# Altium schematic sheet MCU.SchDoc
size A
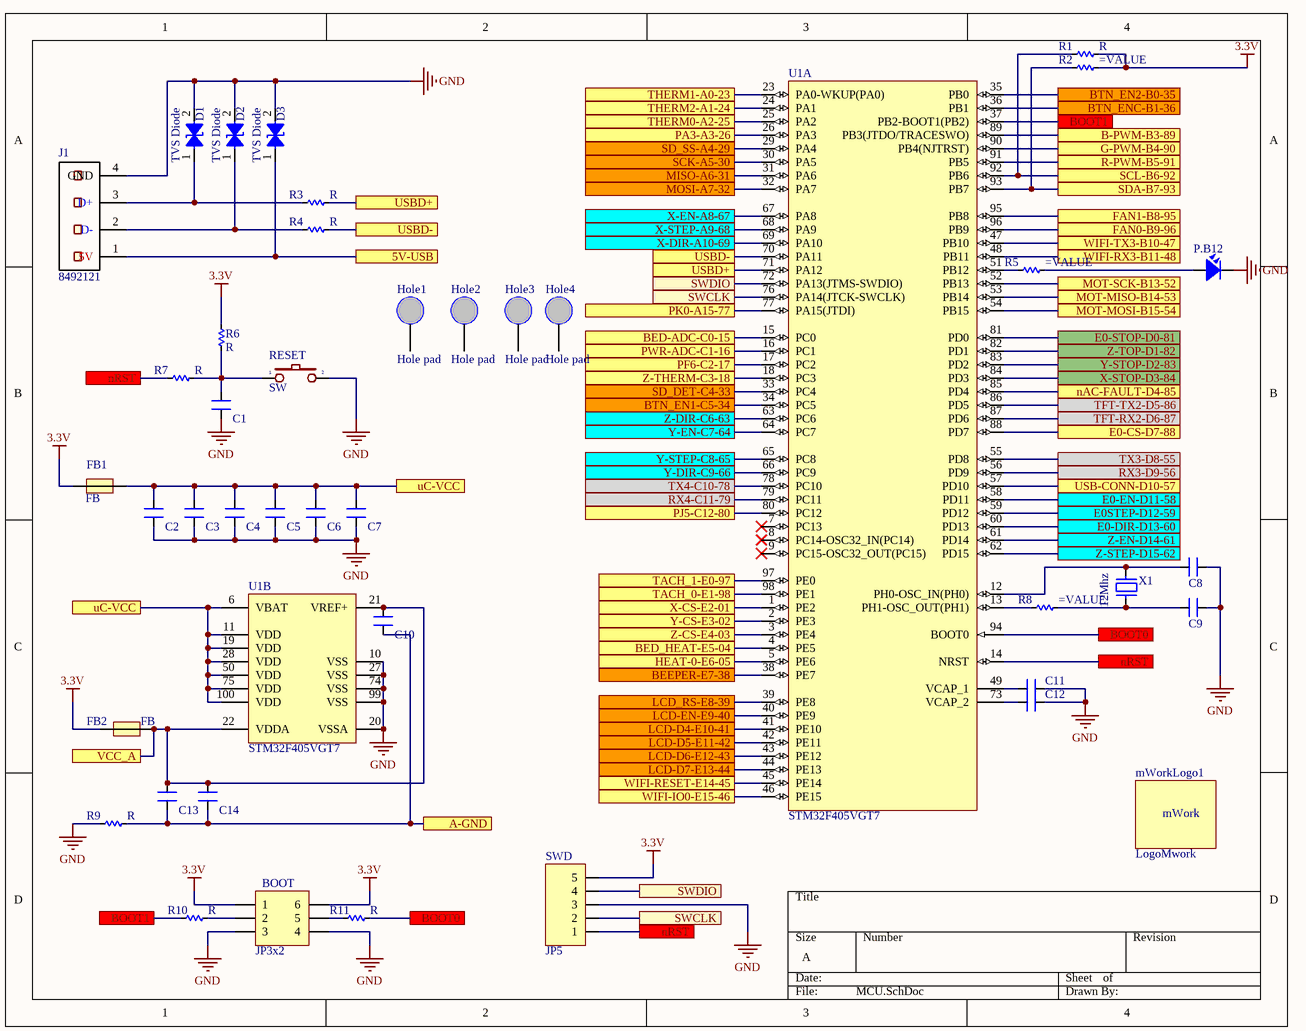
[diagram p0: MCU.SchDoc]

## Parts
BOOT  JP3x2  [JP3-D2T]
C1  CN  [CN-SMD-0603_big]  (value not drawn)
C2  CN  [CN-SMD-0603_big]  (value not drawn)
C3  CN  [CN-SMD-0603_big]  (value not drawn)
C4  CN  [CN-SMD-0603_big]  (value not drawn)
C5  CN  [CN-SMD-0603_big]  (value not drawn)
C6  CN  [CN-SMD-0603_big]  (value not drawn)
C7  CN  [CN-SMD-0603_big]  (value not drawn)
C8  CN  [CN-SMD-0603_big]  (value not drawn)
C9  CN  [CN-SMD-0603_big]  (value not drawn)
C10  CN  [CN-SMD-0603_big]  (value not drawn)
C11  CN  [CN-SMD-0603_big]  (value not drawn)
C12  CN  [CN-SMD-0603_big]  (value not drawn)
C13  CN  [CN-SMD-0603_big]  (value not drawn)
C14  CN  [CN-SMD-0603_big]  (value not drawn)
D1  TVS Diode  [DIO-SMD-214AC]
D2  TVS Diode  [DIO-SMD-214AC]
D3  TVS Diode  [DIO-SMD-214AC]
FB1  FB  [Capacitor_805]
FB2  FB  [Capacitor_805]
Hole1  Hole pad  [HolePad1]
Hole2  Hole pad  [HolePad1]
Hole3  Hole pad  [HolePad1]
Hole4  Hole pad  [HolePad1]
J1  8492121  [USB-C2]
mWorkLogo1  LogoMwork  [LogoMwork15*6]
P.B12  LED  [LED-RED-0805]  (value not drawn)
R1  R  [RES-SMD-0603_BIG]
R2  (no value)  [RES-SMD-0603_BIG]
R3  R  [RES-SMD-0603_BIG]
R4  R  [RES-SMD-0603_BIG]
R5  (no value)  [RES-SMD-0603_BIG]
R6  R  [RES-SMD-0603_BIG]
R7  R  [RES-SMD-0603_BIG]
R8  (no value)  [RES-SMD-0603_BIG]
R9  R  [RES-SMD-0603_BIG]
R10  R  [RES-SMD-0603_BIG]
R11  R  [RES-SMD-0603_BIG]
RESET  SW  [SW1-SMD]
SWD  JP5  [JP5-D1T]
U1  STM32F405VGT7  [STM-LQFP100_N]  (parts A,B of 2)
X1  12Mhz  [XT2]

## Ports
5V-USB, A-GND, B-PWM-B3-89, BED-ADC-C0-15, BED_HEAT-E5-04, BEEPER-E7-38, BOOT0, BOOT1, BTN_EN1-C5-34, BTN_EN2-B0-35, BTN_ENC-B1-36, E0-CS-D7-88, E0-DIR-D13-60, E0-EN-D11-58, E0-STOP-D0-81, E0STEP-D12-59, FAN0-B9-96, FAN1-B8-95, G-PWM-B4-90, HEAT-0-E6-05, LCD-D4-E10-41, LCD-D5-E11-42, LCD-D6-E12-43, LCD-D7-E13-44, LCD-EN-E9-40, LCD_RS-E8-39, MISO-A6-31, MOSI-A7-32, MOT-MISO-B14-53, MOT-MOSI-B15-54, MOT-SCK-B13-52, nAC-FAULT-D4-85, nRST, PA3-A3-26, PF6-C2-17, PJ5-C12-80, PK0-A15-77, PWR-ADC-C1-16, R-PWM-B5-91, RX3-D9-56, RX4-C11-79, SCK-A5-30, SCL-B6-92, SD_DET-C4-33, SD_SS-A4-29, SDA-B7-93, SWCLK, SWDIO, TACH_0-E1-98, TACH_1-E0-97, TFT-RX2-D6-87, TFT-TX2-D5-86, THERM0-A2-25, THERM1-A0-23, THERM2-A1-24, TX3-D8-55, TX4-C10-78, uC-VCC, USB-CONN-D10-57, USBD+, USBD-, VCC_A, WIFI-IO0-E15-46, WIFI-RESET-E14-45, WIFI-RX3-B11-48, WIFI-TX3-B10-47, X-CS-E2-01, X-DIR-A10-69, X-EN-A8-67, X-STEP-A9-68, X-STOP-D3-84, Y-CS-E3-02, Y-DIR-C9-66, Y-EN-C7-64, Y-STEP-C8-65, Y-STOP-D2-83, Z-CS-E4-03, Z-DIR-C6-63, Z-EN-D14-61, Z-STEP-D15-62, Z-THERM-C3-18, Z-TOP-D1-82

## Nets
3.3V: BOOT.1 BOOT.6 FB1.1 FB2.1 R1.2 R2.2 R6.1 SWD.5
GND: BOOT.3 BOOT.4 C1.1 C2.1 C3.1 C4.1 C5.1 C6.1 C7.1 C8.2 C9.2 C11.2 C12.2 D1.2(GND) D2.2(GND) D3.2(GND) J1.4(GND) P.B12.2 R9.2 RESET.2 SWD.3 U1.10(VSS) U1.20(VSSA) U1.27(VSS) U1.74(VSS) U1.99(VSS)
5V-USB: D3.1(I/O_1) J1.1(5V) ; port 5V-USB
A-GND: C10.1 C13.1 C14.1 R9.1 ; port A-GND
B-PWM-B3-89: U1.89(PB3(JTDO/TRACESWO)) ; port B-PWM-B3-89
BED-ADC-C0-15: U1.15(PC0) ; port BED-ADC-C0-15
BED_HEAT-E5-04: U1.4(PE5) ; port BED_HEAT-E5-04
BEEPER-E7-38: U1.38(PE7) ; port BEEPER-E7-38
BOOT0: R11.1 U1.94(BOOT0) ; port BOOT0
BOOT1: R10.2 U1.37(PB2-BOOT1(PB2)) ; port BOOT1
BTN_EN1-C5-34: U1.34(PC5) ; port BTN_EN1-C5-34
BTN_EN2-B0-35: U1.35(PB0) ; port BTN_EN2-B0-35
BTN_ENC-B1-36: U1.36(PB1) ; port BTN_ENC-B1-36
E0-CS-D7-88: U1.88(PD7) ; port E0-CS-D7-88
E0-DIR-D13-60: U1.60(PD13) ; port E0-DIR-D13-60
E0-EN-D11-58: U1.58(PD11) ; port E0-EN-D11-58
E0-STOP-D0-81: U1.81(PD0) ; port E0-STOP-D0-81
E0STEP-D12-59: U1.59(PD12) ; port E0STEP-D12-59
FAN0-B9-96: U1.96(PB9) ; port FAN0-B9-96
FAN1-B8-95: U1.95(PB8) ; port FAN1-B8-95
G-PWM-B4-90: U1.90(PB4(NJTRST)) ; port G-PWM-B4-90
HEAT-0-E6-05: U1.5(PE6) ; port HEAT-0-E6-05
LCD-D4-E10-41: U1.41(PE10) ; port LCD-D4-E10-41
LCD-D5-E11-42: U1.42(PE11) ; port LCD-D5-E11-42
LCD-D6-E12-43: U1.43(PE12) ; port LCD-D6-E12-43
LCD-D7-E13-44: U1.44(PE13) ; port LCD-D7-E13-44
LCD-EN-E9-40: U1.40(PE9) ; port LCD-EN-E9-40
LCD_RS-E8-39: U1.39(PE8) ; port LCD_RS-E8-39
MISO-A6-31: U1.31(PA6) ; port MISO-A6-31
MOSI-A7-32: U1.32(PA7) ; port MOSI-A7-32
MOT-MISO-B14-53: U1.53(PB14) ; port MOT-MISO-B14-53
MOT-MOSI-B15-54: U1.54(PB15) ; port MOT-MOSI-B15-54
MOT-SCK-B13-52: U1.52(PB13) ; port MOT-SCK-B13-52
nAC-FAULT-D4-85: U1.85(PD4) ; port nAC-FAULT-D4-85
nRST: R7.2 SWD.1 U1.14(NRST) ; port nRST
PA3-A3-26: U1.26(PA3) ; port PA3-A3-26
PF6-C2-17: U1.17(PC2) ; port PF6-C2-17
PJ5-C12-80: U1.80(PC12) ; port PJ5-C12-80
PK0-A15-77: U1.77(PA15(JTDI)) ; port PK0-A15-77
PWR-ADC-C1-16: U1.16(PC1) ; port PWR-ADC-C1-16
R-PWM-B5-91: U1.91(PB5) ; port R-PWM-B5-91
RX3-D9-56: U1.56(PD9) ; port RX3-D9-56
RX4-C11-79: U1.79(PC11) ; port RX4-C11-79
SCK-A5-30: U1.30(PA5) ; port SCK-A5-30
SCL-B6-92: R1.1 U1.92(PB6) ; port SCL-B6-92
SD_DET-C4-33: U1.33(PC4) ; port SD_DET-C4-33
SD_SS-A4-29: U1.29(PA4) ; port SD_SS-A4-29
SDA-B7-93: R2.1 U1.93(PB7) ; port SDA-B7-93
SWCLK: SWD.2 U1.76(PA14(JTCK-SWCLK)) ; port SWCLK
SWDIO: SWD.4 U1.72(PA13(JTMS-SWDIO)) ; port SWDIO
TACH_0-E1-98: U1.98(PE1) ; port TACH_0-E1-98
TACH_1-E0-97: U1.97(PE0) ; port TACH_1-E0-97
TFT-RX2-D6-87: U1.87(PD6) ; port TFT-RX2-D6-87
TFT-TX2-D5-86: U1.86(PD5) ; port TFT-TX2-D5-86
THERM0-A2-25: U1.25(PA2) ; port THERM0-A2-25
THERM1-A0-23: U1.23(PA0-WKUP(PA0)) ; port THERM1-A0-23
THERM2-A1-24: U1.24(PA1) ; port THERM2-A1-24
TX3-D8-55: U1.55(PD8) ; port TX3-D8-55
TX4-C10-78: U1.78(PC10) ; port TX4-C10-78
uC-VCC: C2.2 C3.2 C4.2 C5.2 C6.2 C7.2 FB1.2 U1.6(VBAT) U1.11(VDD) U1.19(VDD) U1.28(VDD) U1.50(VDD) U1.75(VDD) U1.100(VDD) ; port uC-VCC
USB-CONN-D10-57: U1.57(PD10) ; port USB-CONN-D10-57
USBD+: R3.1 U1.71(PA12) ; port USBD+
USBD-: R4.1 U1.70(PA11) ; port USBD-
VCC_A: C10.2 C13.2 C14.2 FB2.2 U1.21(VREF+) U1.22(VDDA) ; port VCC_A
WIFI-IO0-E15-46: U1.46(PE15) ; port WIFI-IO0-E15-46
WIFI-RESET-E14-45: U1.45(PE14) ; port WIFI-RESET-E14-45
WIFI-RX3-B11-48: U1.48(PB11) ; port WIFI-RX3-B11-48
WIFI-TX3-B10-47: U1.47(PB10) ; port WIFI-TX3-B10-47
X-CS-E2-01: U1.1(PE2) ; port X-CS-E2-01
X-DIR-A10-69: U1.69(PA10) ; port X-DIR-A10-69
X-EN-A8-67: U1.67(PA8) ; port X-EN-A8-67
X-STEP-A9-68: U1.68(PA9) ; port X-STEP-A9-68
X-STOP-D3-84: U1.84(PD3) ; port X-STOP-D3-84
Y-CS-E3-02: U1.2(PE3) ; port Y-CS-E3-02
Y-DIR-C9-66: U1.66(PC9) ; port Y-DIR-C9-66
Y-EN-C7-64: U1.64(PC7) ; port Y-EN-C7-64
Y-STEP-C8-65: U1.65(PC8) ; port Y-STEP-C8-65
Y-STOP-D2-83: U1.83(PD2) ; port Y-STOP-D2-83
Z-CS-E4-03: U1.3(PE4) ; port Z-CS-E4-03
Z-DIR-C6-63: U1.63(PC6) ; port Z-DIR-C6-63
Z-EN-D14-61: U1.61(PD14) ; port Z-EN-D14-61
Z-STEP-D15-62: U1.62(PD15) ; port Z-STEP-D15-62
Z-THERM-C3-18: U1.18(PC3) ; port Z-THERM-C3-18
Z-TOP-D1-82: U1.82(PD1) ; port Z-TOP-D1-82
NetBOOT_2: BOOT.2 R10.1
NetBOOT_5: BOOT.5 R11.2
NetC1_2: C1.2 R6.2 R7.1 RESET.1
NetC8_1: C8.1 U1.12(PH0-OSC_IN(PH0)) X1.2
NetC9_1: C9.1 R8.2 X1.1
NetC11_1: C11.1 U1.49(VCAP_1)
NetC12_1: C12.1 U1.73(VCAP_2)
NetD1_1: D1.1(I/O_1) J1.3(D+) R3.2
NetD2_1: D2.1(I/O_1) J1.2(D-) R4.2
NetP.B12_1: P.B12.1 R5.2
NetR5_1: R5.1 U1.51(PB12)
NetR8_1: R8.1 U1.13(PH1-OSC_OUT(PH1))

Not connected (* = marked no-connect by the designer): Hole1 1; Hole2 1; Hole3 1; Hole4 1; U1 7(PC13)* 8(PC14-OSC32_IN(PC14))* 9(PC15-OSC32_OUT(PC15))*

## Notes on the sheet
- (in symbol LogoMwork) mWork

## Library data of the parts
BOOT = JP3x2: WR-PHD 2.54 mm Dual Socket Header; Manufacturer: W¨¹rth Elektronik eiSos GmbH; partNo: 61300621821; ComponentLink1 Description: Manufacturer; ComponentLink2 Description: Datasheet; NoPins: 06; Created Date: 29 March 2013; ComponentLink1URL: http://www.we-online.com; ComponentLink2URL: http://katalog.we-online.de/em/datasheet/6130xx21821.pdf; Created by: Karrer Zheng
C1-C14 = CN: Value: 33pF
D1-D3 = TVS Diode: SMAJ5.0A
J1 = USB-4: THT USB 2.0 A Connector WE-EPLE; Manufacturer: Würth Elektronik eiSos GmbH; PartNo: 8492121; ComponentLink1Description: Manufacturer; ComponentLink1URL: http://www.we-online.de; Created by: Christin Otto; Created Date: OCT-2014; ComponentLink2Description: Datasheet; ComponentLink2URL: http://www.we-online.de/katalog/media/pdf/8492121.pdf
P.B12 = LED SMD: Value: LED 3 - 5 ly 2 Colour
R2 R5 R8 = R: Parameter 1: *
RESET = SW2: Switch button 2 pin; Value: SW chip 2 pin
SWD = JP5: WR-PHD 2.54 mm Angled Socket Header; Manufacturer: W¨¹rth Elektronik eiSos GmbH; partNo: 613005143121; ComponentLink1 Description: Manufacturer; ComponentLink2 Description: Datasheet; NoPins: 05; Created Date: 29 March 2013; ComponentLink1URL: http://www.we-online.com; ComponentLink2URL: http://katalog.we-online.de/em/datasheet/6130xx143121.pdf; Created by: Karrer Zheng
U1 = STM32F405VGT7: ARM Cortex-M4 32-bit MCU+FPU, 210 DMIPS, 1024 kB Flash, 192 kB Internal RAM, 82 I/Os, 100-pin LQFP, -40 to 105 degC, Tray; Manufacturer: STMicroelectronics; D/A Converter: 2x12-bit; FLASH Size (Prog) (kB): 1024; I/Os (High Current): 82; Internal RAM Size (kB): 192; Operating Frequency(F) (Processor speed) (MHz): 168; Supply Voltage(Vcc) max (V): 3.6; Supply Voltage(Vcc) min (V): 1.8; DatasheetVersion: Rev. 4; PackageVersion: Rev. 1, 06/2013; PackageReference: LQFP100; PackageDescription: 100-Pin Low Profile Quad Flat Package, 14 x 14 mm Body, 0.5 mm Pitch; Supplier 1: Newark; Supplier Part Number 1: 19X6225; Supplier 2: Mouser; Supplier Part Number 2: 511-STM32F405VGT7; Core: ARM Cortex-M4; Packing: Tray; Mounting Technology: Surface Mount; PartNumber: STM32F405VGT7; ComponentLink1Description: Manufacturer URL; ComponentLink1URL: http://www.st.com/web/en/home.html; ComponentLink2Description: Datasheet; ComponentLink2URL: http://www.st.com/st-web-ui/static/active/en/resource/technical/document/datasheet/DM00037051.pdf; ComponentLink3Description: Package Specification; ComponentLink3URL: http://www.st.com/st-web-ui/static/active/en/resource/technical/document/data_brief/DM00071938.pdf
X1 = XT2: Crystal, 32.768 KHz, -40 to 85 degC, 3.2 x 1.5 x 0.9 mm SMD; Value: 4Mhz